# Altium project carte_ecureuil2026.PrjPcb
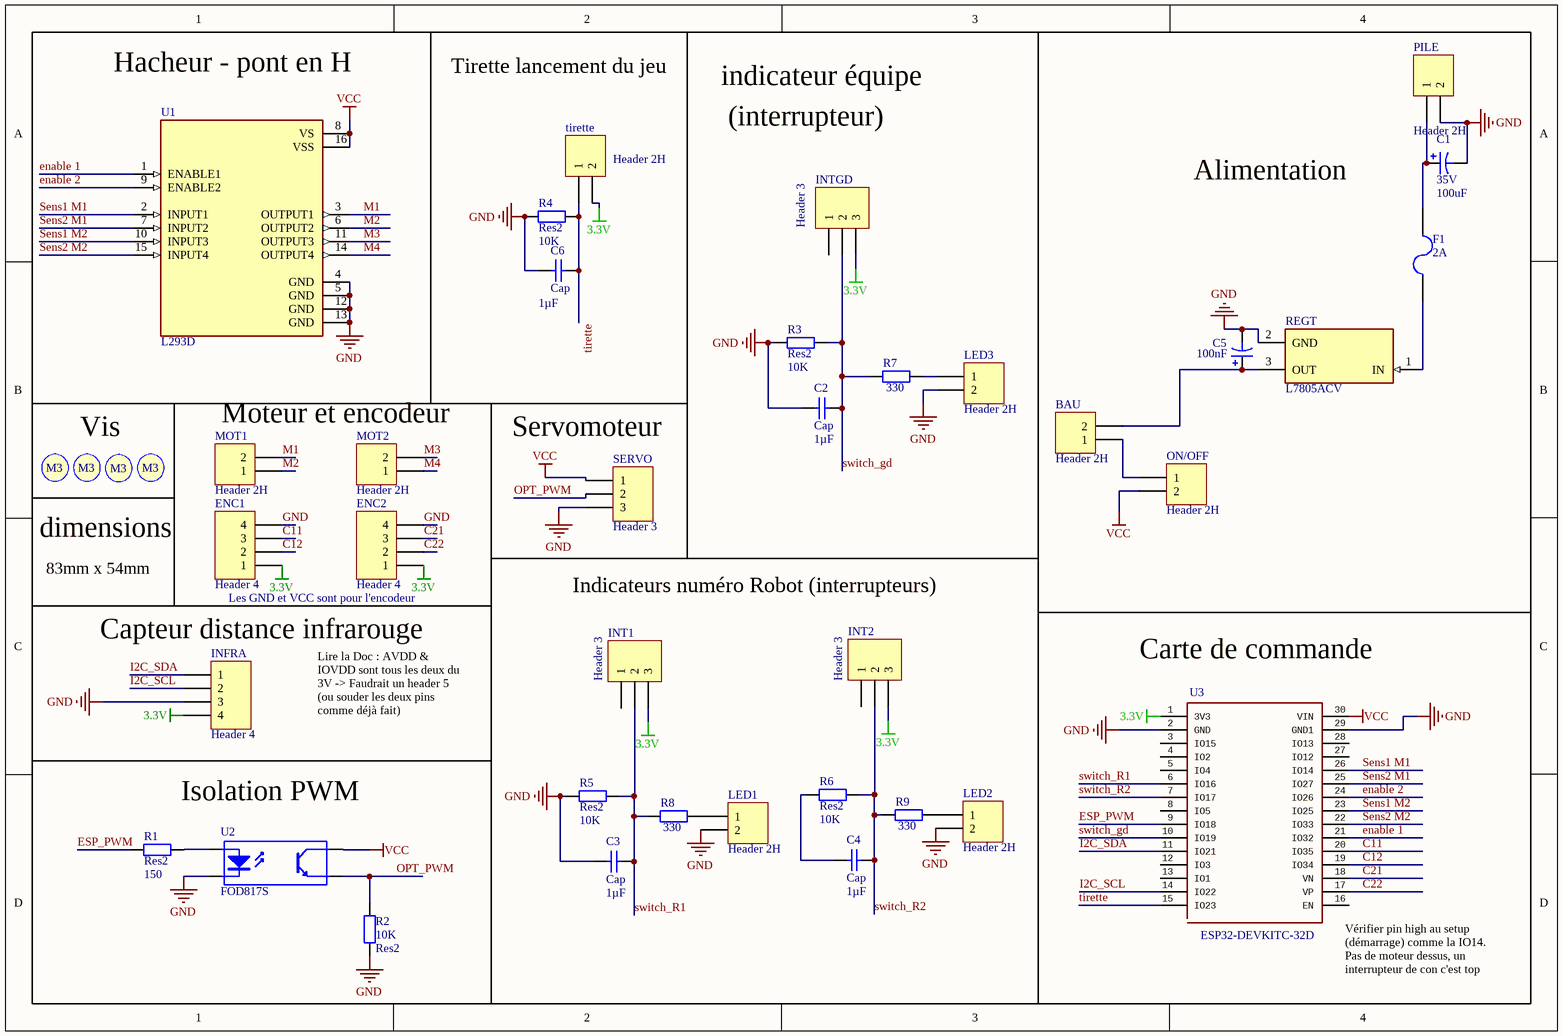
[diagram p0: carte_ecureuil2026.SchDoc]
1 sheet, 40 parts. Net scope: global (net labels, ports and power ports of the same name join across sheets).
Board file: carte_ecureuil2026.PcbDoc

## Sheet carte_ecureuil2026.SchDoc
size A4; SheetNumber: 1; SheetTotal: 1

### Parts
BAU  Header 2H  [JST_B2B-XH-A_(LF)(SN)]
C1  35V  value 100uF  [Condensateur]
C2  Cap  value 1µF  [Capacitor 1206]
C3  Cap  value 1µF  [Capacitor 1206]
C4  Cap  value 1µF  [Capacitor 1206]
C5  value 100nF  [Condensateur]  (hidden comment: 35V)
C6  Cap  value 1µF  [Capacitor 1206]
ENC1  Header 4  [B4BXHALFSN]
ENC2  Header 4  [B4BXHALFSN]
F1  2A  [3.5X2.8X1.9]
INFRA  Header 4  [B4BXHALFSN]
INT1  Header 3  [JST_B3B-XH-A(LF)(SN)]
INT2  Header 3  [JST_B3B-XH-A(LF)(SN)]
INTGD  Header 3  [JST_B3B-XH-A(LF)(SN)]
LED1  Header 2H  [JST_B2B-XH-A_(LF)(SN)]
LED2  Header 2H  [JST_B2B-XH-A_(LF)(SN)]
LED3  Header 2H  [JST_B2B-XH-A_(LF)(SN)]
MOT1  Header 2H  [JST_B2B-XH-A_(LF)(SN)]
MOT2  Header 2H  [JST_B2B-XH-A_(LF)(SN)]
ON/OFF  Header 2H  [JST_B2B-XH-A_(LF)(SN)]
PILE  Header 2H  [JST_B2B-XH-A_(LF)(SN)]
R1  Res2  value 150  [Resistor 1206]
R2  Res2  value 10K  [Resistor 1206]
R3  Res2  value 10K  [Resistor 1206]
R4  Res2  value 10K  [Resistor 1206]
R5  Res2  value 10K  [Resistor 1206]
R6  Res2  value 10K  [Resistor 1206]
R7  value 330  [Resistor 1206]  (hidden comment: Res2)
R8  value 330  [Resistor 1206]  (hidden comment: Res2)
R9  value 330  [Resistor 1206]  (hidden comment: Res2)
REGT  L7805ACV  [TO254P460X1020X1945-3P]
S1  Screw M3  [Screw M3]  (value not drawn)
S2  Screw M3  [Screw M3]  (value not drawn)
S3  Screw M3  [Screw M3]  (value not drawn)
S4  Screw M3  [Screw M3]  (value not drawn)
SERVO  Header 3  [JST_B3B-XH-A(LF)(SN)]
tirette  Header 2H  [JST_B2B-XH-A_(LF)(SN)]
U1  L293D  [DIP880W50P254L2000H510Q16]
U2  FOD817S  [SOP254P1016X385-4N]
U3  ESP32-DEVKITC-32D  [MODULE_ESP32-DEVKITV1]

### Blocks framed on the sheet
Hacheur - pont en H: U1
Tirette lancement du jeu: C6 R4 tirette
Alimentation: BAU C1 C5 F1 ON/OFF PILE REGT
Vis: S1-S4
Moteur et encodeur: ENC1 ENC2 MOT1 MOT2
Servomoteur: SERVO
Indicateurs numéro Robot (interrupteurs): C3 C4 INT1 INT2 LED1 LED2 R5 R6 R8 R9
Capteur distance infrarouge: INFRA
Carte de commande: U3
Isolation PWM: R1 R2 U2

### Nets
3.3V: ENC1.1 ENC2.1 INFRA.4 INT1.3 INT2.3 INTGD.3 tirette.2 U3.1(3V3)
GND: C1.2 C2.1 C3.1 C5.2 C6.1 ENC1.4 ENC2.4 INFRA.3 LED1.2 LED2.2 LED3.2 PILE.2 R2.1 R3.1 R4.1 R5.1 REGT.2(GND) SERVO.3 U1.4(GND) U1.5(GND) U1.12(GND) U1.13(GND) U2.2(K) U3.2(GND) U3.29(GND1)
VCC: ON/OFF.2 SERVO.1 U1.8(VS) U1.16(VSS) U2.4(C) U3.30(VIN)
C11: ENC1.3 U3.20(IO35)
C12: ENC1.2 U3.19(IO34)
C21: ENC2.3 U3.18(VN)
C22: ENC2.2 U3.17(VP)
enable 1: U1.1(ENABLE1) U3.21(IO32)
enable 2: U1.9(ENABLE2) U3.24(IO26)
ESP_PWM: R1.1 U3.9(IO18)
I2C_SCL: INFRA.2 U3.14(IO22)
I2C_SDA: INFRA.1 U3.11(IO21)
M1: MOT1.2 U1.3(OUTPUT1)
M2: MOT1.1 U1.6(OUTPUT2)
M3: MOT2.2 U1.11(OUTPUT3)
M4: MOT2.1 U1.14(OUTPUT4)
OPT_PWM: R2.2 SERVO.2 U2.3(E)
Sens1 M1: U1.2(INPUT1) U3.26(IO14)
Sens1 M2: U1.10(INPUT3) U3.23(IO25)
Sens2 M1: U1.7(INPUT2) U3.25(IO27)
Sens2 M2: U1.15(INPUT4) U3.22(IO33)
switch_gd: C2.2 INTGD.2 R3.2 R7.1 U3.10(IO19)
switch_R1: C3.2 INT1.2 R5.2 R8.1 U3.6(IO16)
switch_R2: C4.2 INT2.2 R6.2 R9.1 U3.7(IO17)
tirette: C6.2 R4.2 tirette.1 U3.15(IO23)
NetBAU_1: BAU.1 ON/OFF.1
NetBAU_2: BAU.2 C5.1 REGT.3(OUT)
NetC1_1: C1.1 F1.2 PILE.1
NetC4_1: C4.1 R6.1
NetF1_1: F1.1 REGT.1(IN)
NetLED1_1: LED1.1 R8.2
NetLED2_1: LED2.1 R9.2
NetLED3_1: LED3.1 R7.2
NetR1_2: R1.2 U2.1(A)

Not connected (* = marked no-connect by the designer): INT1 1; INT2 1; INTGD 1; U3 3(IO15) 4(IO2) 5(IO4) 8(IO5) 12(IO3) 13(IO1) 16(EN) 27(IO12) 28(IO13)

### Notes on the sheet
- indicateur équipe
- (interrupteur)
- dimensions
- 83mm x 54mm
- Les GND et VCC sont pour l'encodeur
- Lire la Doc : AVDD & IOVDD sont tous les deux du 3V -> Faudrait un header 5 (ou souder les deux pins comme déjà fait)
- (near U3) Vérifier pin high au setup (démarrage) comme la IO14. Pas de moteur dessus, un interrupteur de con c'est top
- (in symbol Screw M3) M3

### Library data of the parts
BAU LED1-LED3 MOT1 MOT2 ON/OFF PILE tirette = Header 2H: Header, 2-Pin, Right Angle; LatestRevisionDate: 17-Jul-2002; LatestRevisionNote: Re-released for DXP Platform.; Publisher: Altium Limited
C1 C5 = Cap Pol1: Polarized Capacitor (Radial); Published: 8-Jun-2000; LatestRevisionDate: 17-Jul-2002; LatestRevisionNote: Re-released for DXP Platform.; PackageReference: RB7.6-15; Publisher: Altium Limited; PackageDescription: Polarized Capacitor (Radial); 2 Leads
C2-C4 C6 = Cap: Capacitor; Published: 8-Jun-2000; LatestRevisionDate: 17-Jul-2002; LatestRevisionNote: Re-released for DXP Platform.; PackageReference: RAD-0.3; Publisher: Altium Limited; PackageDescription: Radial Cap, Thru-Hole; 2 Leads; 0.3 in Pin Spacing
ENC1 ENC2 INFRA = Header 4: Header, 4-Pin; LatestRevisionDate: 17-Jul-2002; LatestRevisionNote: Re-released for DXP Platform.; Publisher: Altium Limited
F1 = Fuse 2: Resettable Fuse αA / JF; Published: 8-Jun-2000; LatestRevisionDate: 17-Jul-2002; LatestRevisionNote: Re-released for DXP Platform.; PackageReference: PIN-W2/E2.8; Publisher: Altium Limited; PackageDescription: Thru-Hole; 2 Leads
INT1 INT2 INTGD SERVO = Header 3: Header, 3-Pin; LatestRevisionDate: 17-Jul-2002; LatestRevisionNote: Re-released for DXP Platform.; Publisher: Altium Limited
R1-R9 = Res2: Resistor; Published: 8-Jun-2000; LatestRevisionDate: 17-Jul-2002; LatestRevisionNote: Re-released for DXP Platform.; PackageReference: AXIAL-0.4; Publisher: Altium Limited; PackageDescription: Axial Device, Thru-Hole; 2 Leads; 0.4 in Pin Spacing
REGT = L7805ACV: Linear Voltage Regulator IC Positive Fixed 1 Output 1.5A TO-220; MF: STMicroelectronics; SnapEDA_Link: https://www.snapeda.com/parts/L7805ACV/STMicroelectronics/view-part/?ref=snap; Package: TO-220-3 STMicroelectronics; Value: *; MP: L7805ACV; Check_prices: https://www.snapeda.com/parts/L7805ACV/STMicroelectronics/view-part/?ref=eda
U1 = L293D: Bipolar Motor Driver - Parallel 16-PowerDIP; MF: STMicroelectronics; MP: L293D; Package: DIP-16 STMicroelectronics; SnapEDA_Link: https://www.snapeda.com/parts/L293D/STMicroelectronics/view-part/?ref=snap; Purchase-URL: https://pricing.snapeda.com/search/part/L293D/?ref=eda; Check_prices: https://www.snapeda.com/parts/L293D/STMicroelectronics/view-part/?ref=eda; Availability: In Stock; Value: *; Price: None
U2 = Optoisolator1: 4-Pin Phototransistor Optocoupler; Published: 24-Mar-1999; LatestRevisionDate: 04-Mar-2005; LatestRevisionNote: Sch pins 3 & 4 Swapped.; DatasheetVersion: Nov-2003; PackageReference: DIP-4; Publisher: Altium Limited
U3 = ESP32-DEVKITC-32D: Eval Board For Esp-Wroom-32; MF: Espressif Systems; Availability: Unavailable; Package: None; SnapEDA_Link: https://www.snapeda.com/parts/ESP32-DEVKITC-32D/Espressif%20Systems/view-part/?ref=snap; MP: ESP32-DEVKITC-32D; Price: None; Value: *